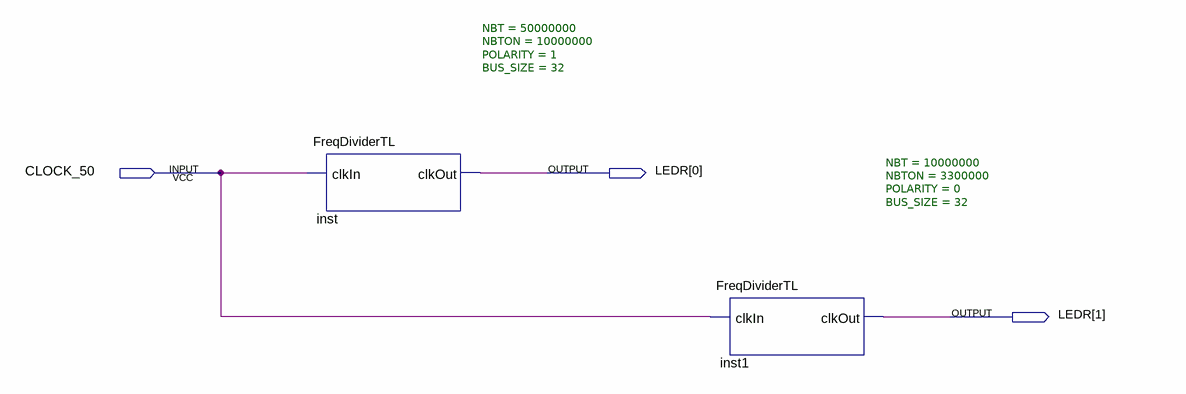
[diagram p0: schematic sheet]
// Quartus schematic BlockDiviseur.bdf as structural Verilog: 2 symbols, 3 pins
module BlockDiviseur (
  input  CLOCK_50,
  output [1:0] LEDR
);

  FreqDividerTL #(.NBT(50000000), .NBTON(10000000), .POLARITY(1), .BUS_SIZE(32)) inst (
    .clkIn(CLOCK_50), .clkOut(LEDR[0]));
  FreqDividerTL #(.NBT(10000000), .NBTON(3300000), .POLARITY(0), .BUS_SIZE(32)) inst1 (
    .clkIn(CLOCK_50), .clkOut(LEDR[1]));
endmodule
